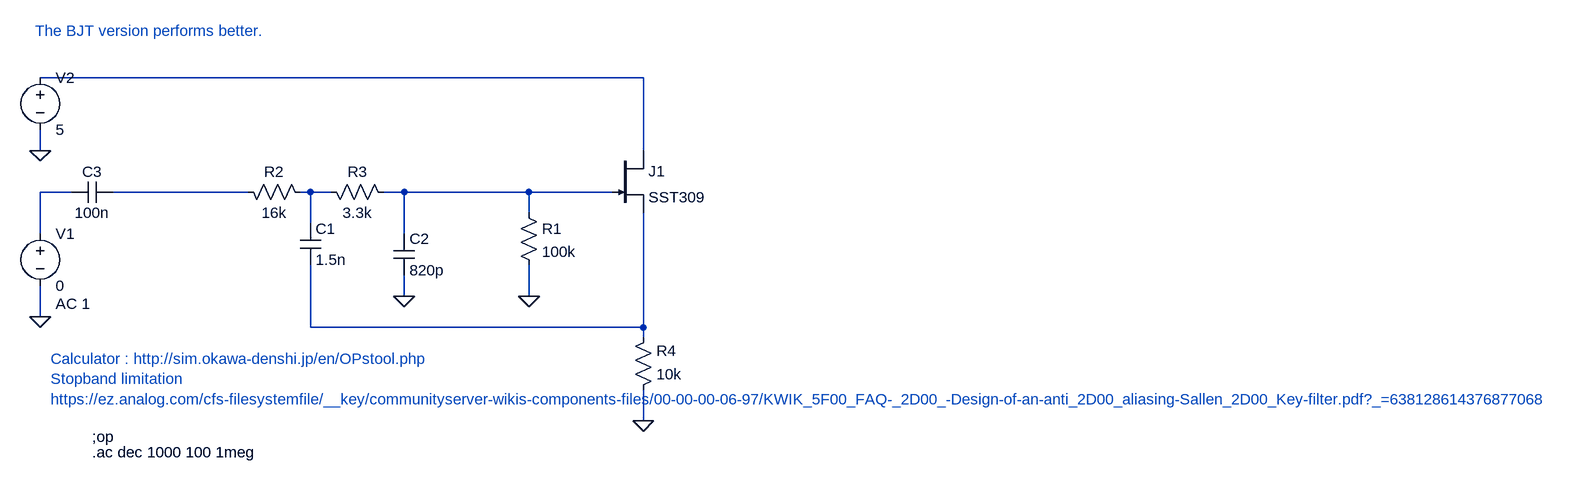
[diagram p0: schematic filter3.asc]
filter3.asc, the LTspice schematic file:
Version 4
SHEET 1 2504 680
WIRE 848 -176 -80 -176
WIRE -80 -64 -80 -96
WIRE 848 -64 848 -176
WIRE -32 0 -80 0
WIRE 240 0 32 0
WIRE 336 0 320 0
WIRE 368 0 336 0
WIRE 480 0 448 0
WIRE 672 0 480 0
WIRE 800 0 672 0
WIRE 672 32 672 0
WIRE 336 48 336 0
WIRE -80 64 -80 0
WIRE 480 64 480 0
WIRE 480 160 480 128
WIRE 672 160 672 112
WIRE -80 192 -80 144
WIRE 336 208 336 112
WIRE 848 208 848 32
WIRE 848 208 336 208
WIRE 848 224 848 208
WIRE 848 352 848 304
FLAG -80 -64 0
FLAG -80 192 0
FLAG 480 160 0
FLAG 848 352 0
FLAG 672 160 0
DATAFLAG 736 208 ""
DATAFLAG 160 0 ""
SYMBOL voltage -80 48 R0
WINDOW 123 24 124 Left 2
WINDOW 39 0 0 Left 0
SYMATTR Value2 AC 1
SYMATTR InstName V1
SYMATTR Value 0
SYMBOL res 224 -16 M90
WINDOW 0 0 56 VBottom 2
WINDOW 3 32 56 VTop 2
SYMATTR InstName R2
SYMATTR Value 16k
SYMBOL res 352 -16 M90
WINDOW 0 0 56 VBottom 2
WINDOW 3 32 56 VTop 2
SYMATTR InstName R3
SYMATTR Value 3.3k
SYMBOL res 832 320 M180
WINDOW 0 36 76 Left 2
WINDOW 3 36 40 Left 2
SYMATTR InstName R4
SYMATTR Value 10k
SYMBOL cap 320 48 R0
SYMATTR InstName C1
SYMATTR Value 1.5n
SYMBOL cap 464 64 R0
SYMATTR InstName C2
SYMATTR Value 820p
SYMBOL voltage -80 -192 R0
SYMATTR InstName V2
SYMATTR Value 5
SYMBOL cap 32 -16 R90
WINDOW 0 0 32 VBottom 2
WINDOW 3 32 32 VTop 2
SYMATTR InstName C3
SYMATTR Value 100n
SYMBOL njf 800 -64 R0
SYMATTR InstName J1
SYMATTR Value SST309
SYMBOL res 656 16 R0
SYMATTR InstName R1
SYMATTR Value 100k
TEXT 0 376 Left 2 !;op
TEXT 0 400 Left 2 !.ac dec 1000 100 1meg
TEXT -64 256 Left 2 ;Calculator : http://sim.okawa-denshi.jp/en/OPstool.php\nStopband limitation\nhttps://ez.analog.com/cfs-filesystemfile/__key/communityserver-wikis-components-files/00-00-00-06-97/KWIK_5F00_FAQ-_2D00_-Design-of-an-anti_2D00_aliasing-Sallen_2D00_Key-filter.pdf?_=638128614376877068
TEXT -88 -248 Left 2 ;The BJT version performs better.

The netlist it stands for:
* filter3.asc
V1 N002 0 0 AC 1
R2 N003 N004 16k
R3 N004 N005 3.3k
R4 0 N006 10k
C1 N004 N006 1.5n
C2 N005 0 820p
V2 N001 0 5
C3 N003 N002 100n
J1 N001 N005 N006 SST309
R1 N005 0 100k
.model NJF NJF
.model PJF PJF
.lib standard.jft
;op
.ac dec 1000 100 1meg
* Calculator : http://sim.okawa-denshi.jp/en/OPstool.php
* Stopband limitation
* https://ez.analog.com/cfs-filesystemfile/__key/communityserver-wikis-components-files/00-00-00-06-97/KWIK_5F00_FAQ-_2D00_-Design-of-an-anti_2D00_aliasing-Sallen_2D00_Key-filter.pdf?_=638128614376877068
* The BJT version performs better.
.backanno
.end